# EAGLE design TSL2561_5V_REV-A - Copy (EAGLE 8.5.2)
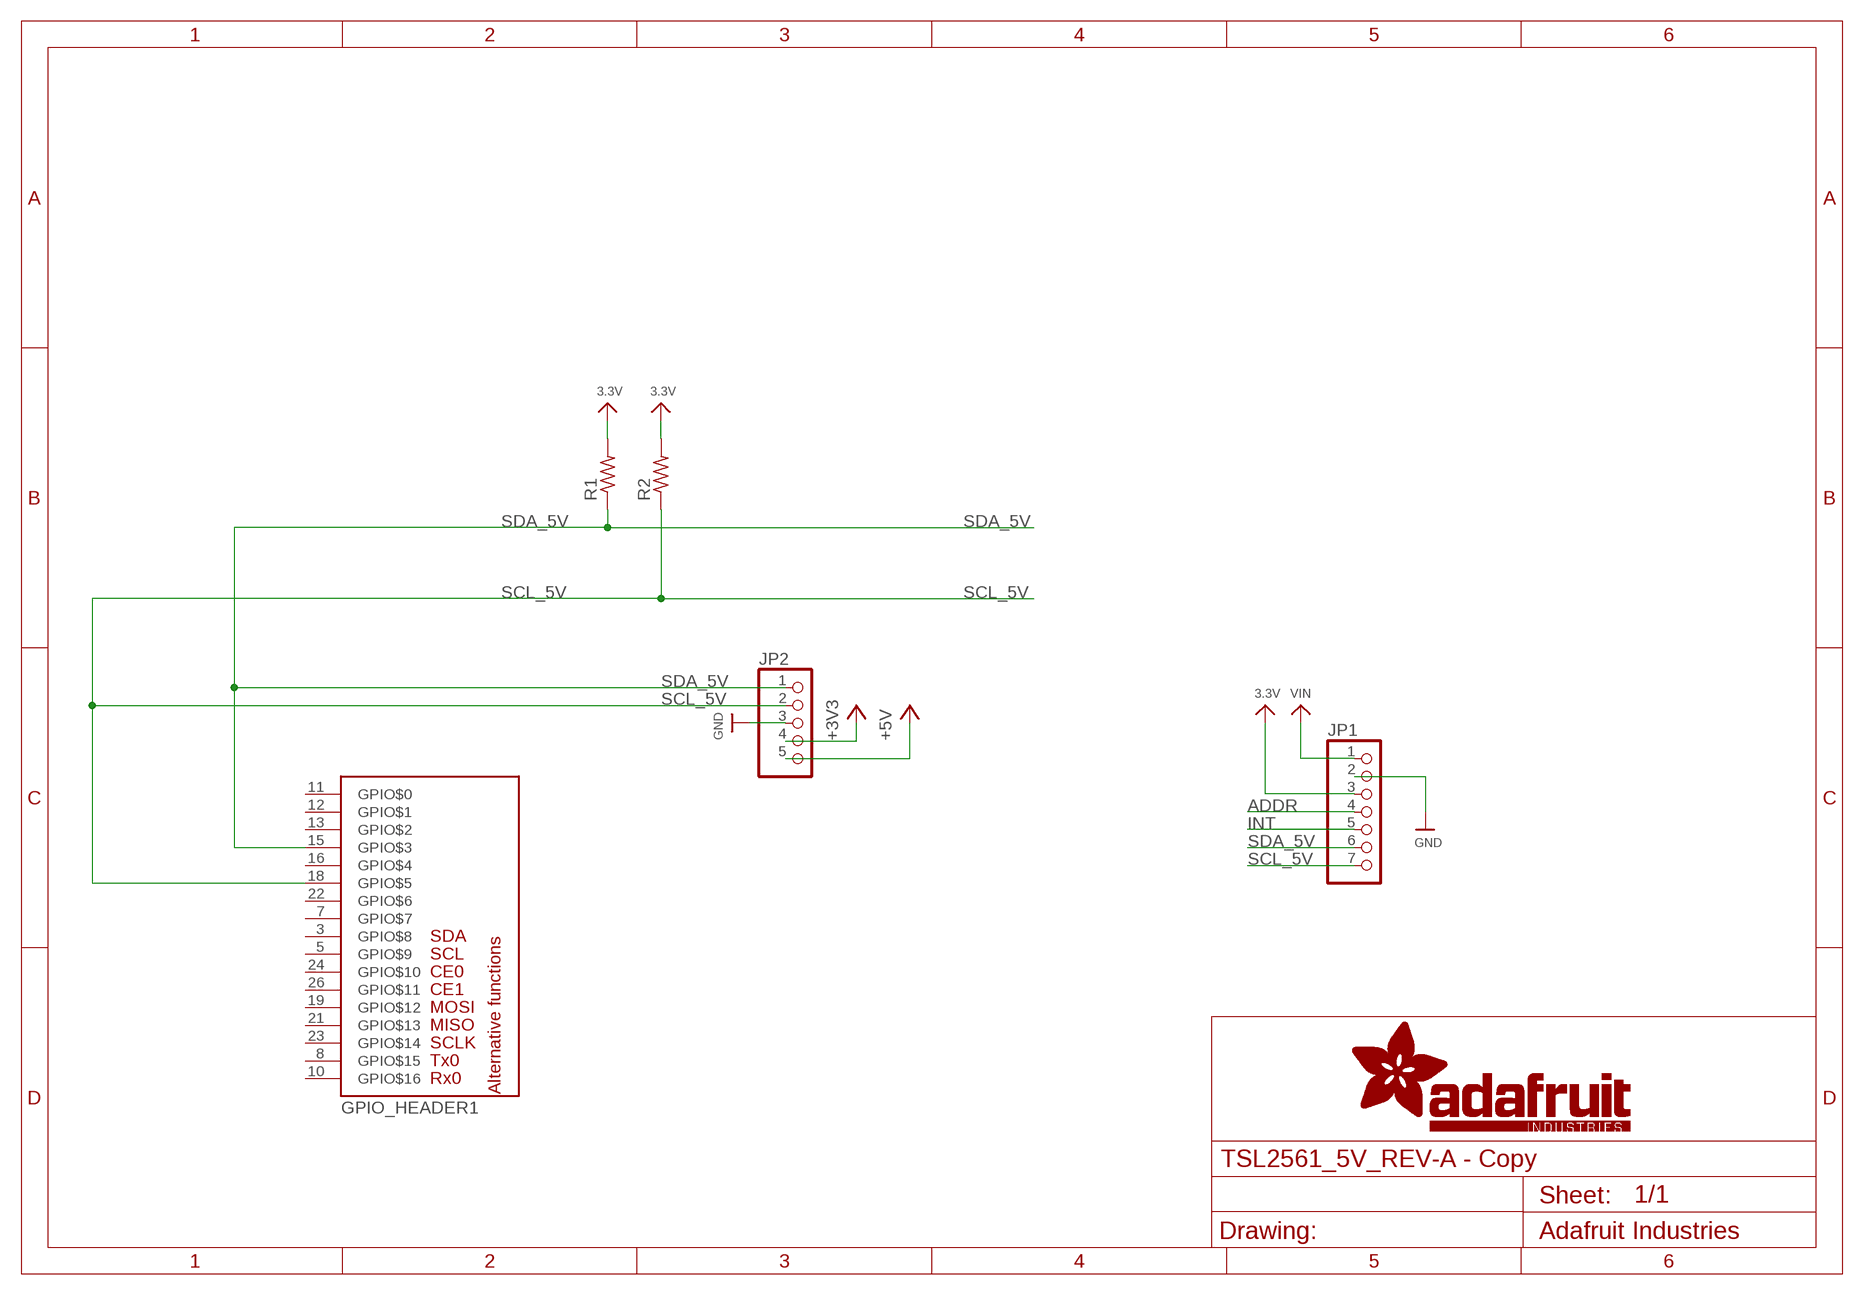
[diagram p0: schematic, sheet 1]

## Parts
GPIO_HEADER1  RPI_GPIO_HEADER  [2X13]
JP1  HEADER-1X7THICKER  [1X07_ROUND_76]
JP2  HEADER-1X570MIL  [1X05_ROUND_70]
R1  R-US_0204/2V  [0204V]
R2  R-US_0204/2V  [0204V]

## Nets
3.3V: JP1.3 R1.2 R2.2
+3V3: JP2.4
ADDR: JP1.4
GND: JP1.2 JP2.3
INT: JP1.5
SCL_5V: GPIO_HEADER1.18(GPIO$5) JP1.7 JP2.2 R2.1
SDA_5V: GPIO_HEADER1.15(GPIO$3) JP1.6 JP2.1 R1.1
VIN: JP1.1 JP2.5 ; supply symbol labelled +5V
Unconnected: GPIO_HEADER1.3(GPIO$8) GPIO_HEADER1.5(GPIO$9) GPIO_HEADER1.7(GPIO$7) GPIO_HEADER1.8(GPIO$15) GPIO_HEADER1.10(GPIO$16) GPIO_HEADER1.11(GPIO$0) GPIO_HEADER1.12(GPIO$1) GPIO_HEADER1.13(GPIO$2) GPIO_HEADER1.16(GPIO$4) GPIO_HEADER1.19(GPIO$12) GPIO_HEADER1.21(GPIO$13) GPIO_HEADER1.22(GPIO$6) GPIO_HEADER1.23(GPIO$14) GPIO_HEADER1.24(GPIO$10) GPIO_HEADER1.26(GPIO$11)

## Power pins joined to a net without a drawn wire
+3V3: GPIO_HEADER1.1(+3V3) GPIO_HEADER1.17(+3V3)
+5V: GPIO_HEADER1.2(+5V) GPIO_HEADER1.4(+5V)
GND: GPIO_HEADER1.6(GND) GPIO_HEADER1.9(GND) GPIO_HEADER1.14(GND) GPIO_HEADER1.20(GND) GPIO_HEADER1.25(GND)

## Library data of the parts
GPIO_HEADER1 = rpi-header:RPI_GPIO_HEADER: Raspberry PI GPIO Header (raspberry pi rev 2). Numbering is taken from WiringPi http://wiringpi.com/pins/ .
JP1 = microbuilder:HEADER-1X7: PIN HEADER
JP2 = microbuilder:HEADER-1X5: PIN HEADER
R1 R2 = adafruit:R-US_: RESISTOR, American symbol

## Board
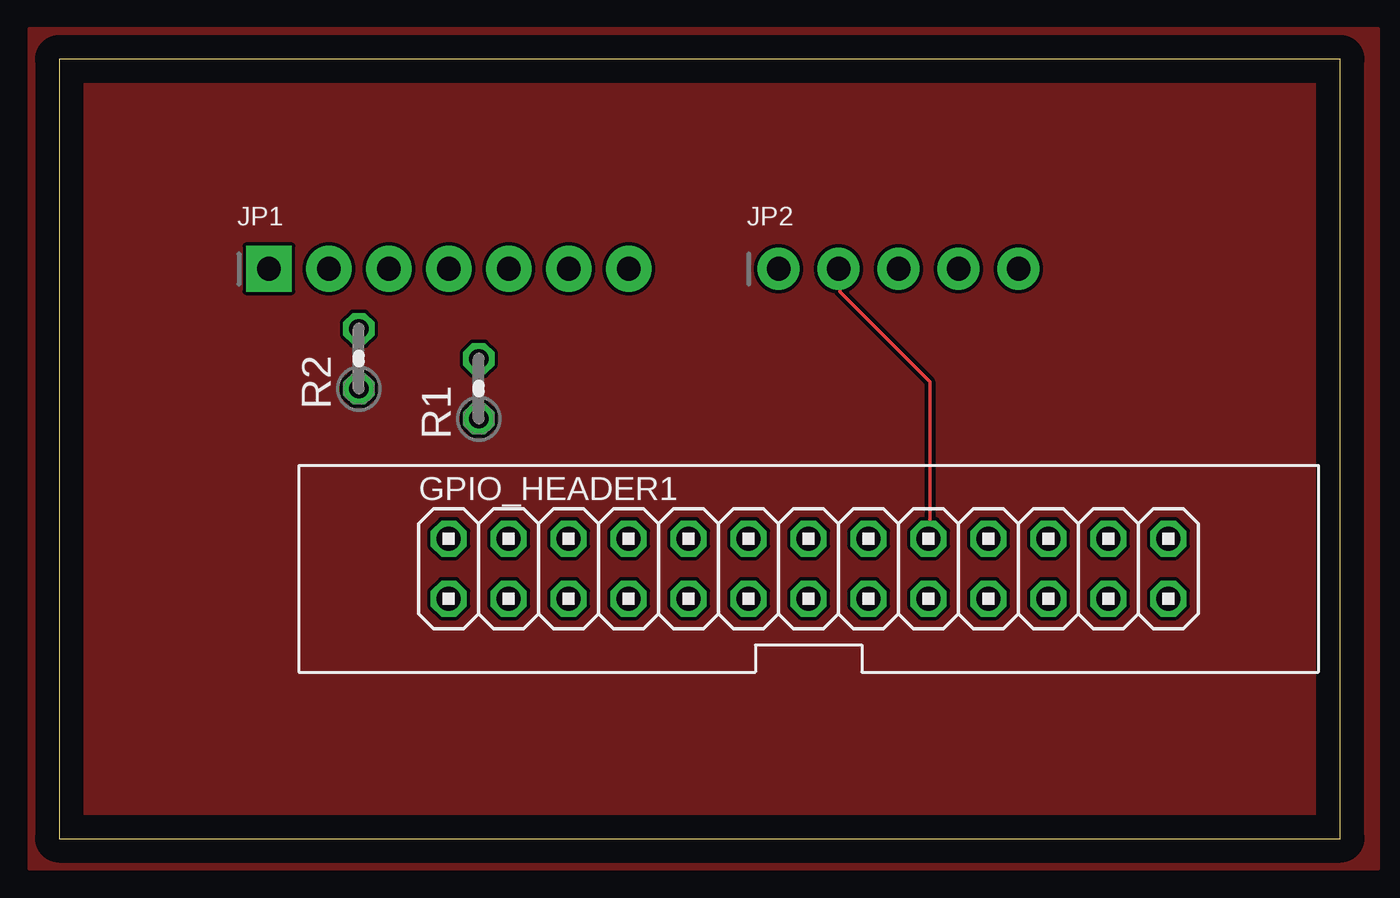
[diagram p1: board, top side]
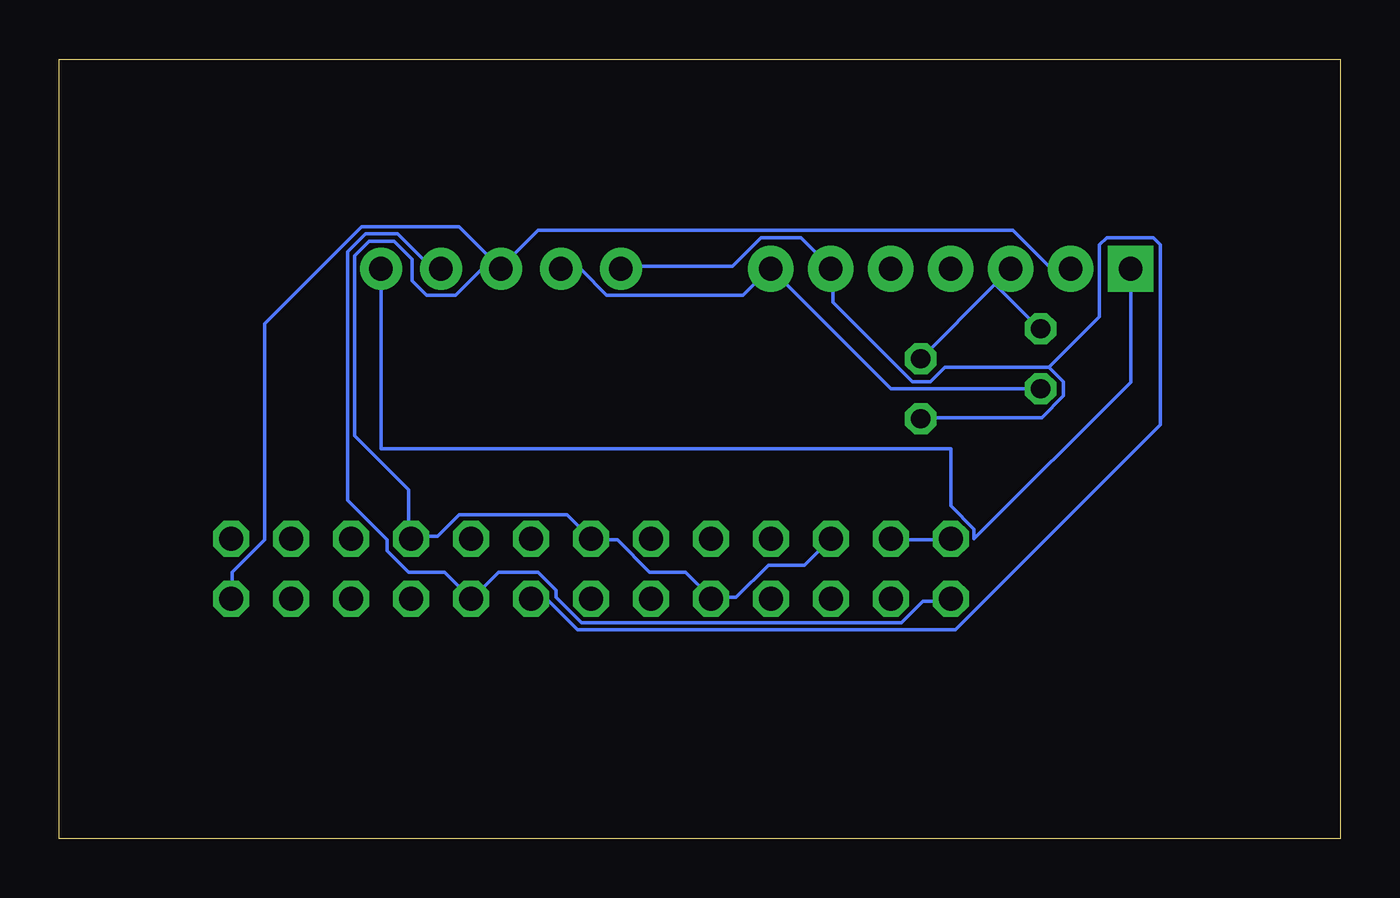
[diagram p2: board, bottom side, seen from below]

Size 54.28 x 33.01 mm. Coordinates in mm from the lower left corner, seen from the top.
Outline: 0,0 54.28,0 54.28,33.01 0,33.01 0,0
Copper layers (1*16): Top 0.035mm / dielectric 1.5mm / Bottom 0.035mm
Design rules "default": minimum track width 6mil, minimum drill 0.35mm, track to track 6mil, track to pad 6mil, pad to pad 6mil, via to via 6mil, smd to smd 6mil, copper to edge 40mil, drill to drill 6mil, minimum pad ring 10mil, minimum via ring 8mil, stop-mask expansion 4mil, vias tented up to drill 0mil, thermal gap 10mil

### Footprints (pad centres in the part's own frame; a part is rotated, then mirrored left to right if it is on the bottom)
2X13 = drill 1.016 octagon: 1 -15.24,-1.27; 2 -15.24,1.27; 3 -12.7,-1.27; 4 -12.7,1.27; 5 -10.16,-1.27; 6 -10.16,1.27; 7 -7.62,-1.27; 8 -7.62,1.27; 9 -5.08,-1.27; 10 -5.08,1.27; 11 -2.54,-1.27; 12 -2.54,1.27; 13 0,-1.27; 14 0,1.27; 15 2.54,-1.27; 16 2.54,1.27; 17 5.08,-1.27; 18 5.08,1.27; 19 7.62,-1.27; 20 7.62,1.27; 21 10.16,-1.27; 22 10.16,1.27; 23 12.7,-1.27; 24 12.7,1.27; 25 15.24,-1.27; 26 15.24,1.27
1X07_ROUND_76 = drill 1 pad 1.93 square: 1 -7.62,0 | drill 1 pad 1.93: 2 -5.08,0; 3 -2.54,0; 4 0,0; 5 2.54,0; 6 5.08,0; 7 7.62,0
1X05_ROUND_70 = drill 1 pad 1.778: 1 -5.08,0; 2 -2.54,0; 3 0,0; 4 2.54,0; 5 5.08,0
0204V = drill 0.813 octagon: 1 -1.27,0; 2 1.27,0

### Placement (x,y rotation side)
GPIO_HEADER1  31.75,11.43 0 top
JP1  16.51,24.13 0 top
JP2  35.56,24.13 0 top
R1  17.78,19.05 90 top
R2  12.7,20.32 90 top

### Tracks (layer width: path | path; a pad name or v marks a point on that pad's centre or on a via)
3.3V
  Bottom 0.152: 14.63,23.47 JP1.3 14.02,24.08 | 14.63,23.47 R1.2 | 14.63,23.47 12.8,21.64 R2.2
+3V3
  Bottom 0.152: GPIO_HEADER1.1 16.61,10.06 17.68,10.06 18.59,9.14 32.16,9.14 33.22,10.21 33.22,10.52 33.98,11.28 35.66,11.28 36.73,10.21 GPIO_HEADER1.17 37.95,11.28 39.47,11.28 40.39,12.19 40.39,12.65 42.06,14.33 42.06,24.84 41.3,25.6 39.93,25.6 38.56,24.23 38.1,24.23 JP2.4
+5V
  Bottom 0.152: GPIO_HEADER1.2 16.61,12.65 19.05,12.65 GPIO_HEADER1.4
GND
  Bottom 0.152: 26.67,10.21 25.6,10.21 24.23,11.58 22.71,11.58 GPIO_HEADER1.6 | 26.67,10.21 27.74,11.28 29.26,11.28 30.63,12.65 31.7,12.65 GPIO_HEADER1.14 32.77,13.72 37.34,13.72 38.25,12.8 39.32,12.8 GPIO_HEADER1.20 39.47,12.8 39.47,14.78 41.76,17.07 41.76,24.69 41.15,25.3 40.08,25.3 39.32,24.54 39.32,23.62 38.71,23.01 37.49,23.01 35.97,24.54 | 26.67,10.21 GPIO_HEADER1.9 | JP2.3 35.97,24.54 | 35.97,24.54 37.34,25.91 41.45,25.91 45.57,21.79 45.57,12.65 46.94,11.28 46.94,10.21 GPIO_HEADER1.25 | JP1.2 11.43,24.23 12.34,24.23 13.87,25.76 33.98,25.76 35.51,24.23 JP2.3 | 35.66,24.23 JP2.3
NAME
  pour Top: 0,34.29 55.88,34.29 55.88,-1.27 -1.27,-1.27 -1.27,34.29
SCL_5V
  Top 0.152: GPIO_HEADER1.18 36.88,12.8 36.88,19.36 33.07,23.16 33.07,24.08 JP2.2
  Bottom 0.152: R2.1 19.05,19.05 JP1.7 24.23,24.08 25.3,23.01 31.09,23.01 32.16,24.08 32.92,24.08 JP2.2
SDA_5V
  Bottom 0.152: 12.34,19.96 11.73,19.36 11.73,18.75 12.65,17.83 17.68,17.83 R1.1 | 12.34,19.96 16.76,19.96 17.37,19.36 18.14,19.36 21.49,22.71 21.49,24.08 JP1.6 21.64,24.23 22.86,25.45 24.54,25.45 25.76,24.23 30.48,24.23 JP2.1 | 12.34,19.96 10.21,22.1 10.21,25.15 9.91,25.45 7.92,25.45 7.62,25.15 7.62,17.53 16.31,8.84 32.31,8.84 33.53,10.06 34.29,10.06 GPIO_HEADER1.15
VIN
  Bottom 0.152: JP1.1 8.89,19.33 15.52,12.7 15.52,13.11 16.51,14.1 16.51,16.51 40.64,16.51 JP2.5